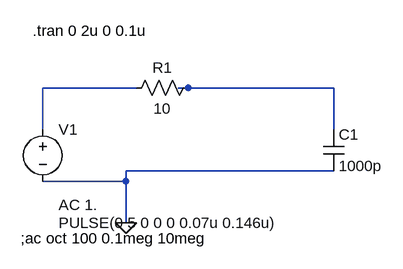
[diagram p0: schematic CR Fil 1D.asc]
CR Fil 1D.asc, the LTspice schematic file:
Version 4
SHEET 1 880 680
WIRE 192 64 48 64
WIRE 272 64 256 64
WIRE 496 64 272 64
WIRE 48 128 48 64
WIRE 496 128 496 64
WIRE 496 192 176 192
WIRE 176 208 176 192
WIRE 176 208 48 208
WIRE 176 272 176 208
FLAG 176 272 0
SYMBOL voltage 48 112 R0
WINDOW 3 24 160 Left 0
WINDOW 123 24 132 Left 0
WINDOW 39 0 0 Left 0
SYMATTR InstName V1
SYMATTR Value PULSE(0 5 0 0 0 0.07u 0.146u)
SYMATTR Value2 AC 1.
SYMBOL res 176 80 R270
WINDOW 0 32 56 VTop 0
WINDOW 3 0 56 VBottom 0
SYMATTR InstName R1
SYMATTR Value 10
SYMBOL cap 480 128 R0
SYMATTR InstName C1
SYMATTR Value 1000p
TEXT 14 296 Left 0 !;ac oct 100 0.1meg 10meg
TEXT 32 -24 Left 0 !.tran 0 2u 0 0.1u

The netlist it stands for:
* CR Fil 1D.asc
V1 N001 0 PULSE(0 5 0 0 0 0.07u 0.146u) AC 1.
R1 N001 N002 10
C1 N002 0 1000p
;ac oct 100 0.1meg 10meg
.tran 0 2u 0 0.1u
.backanno
.end